# EAGLE design PCF8563-Bob-v1.0 (EAGLE 7.0.0)
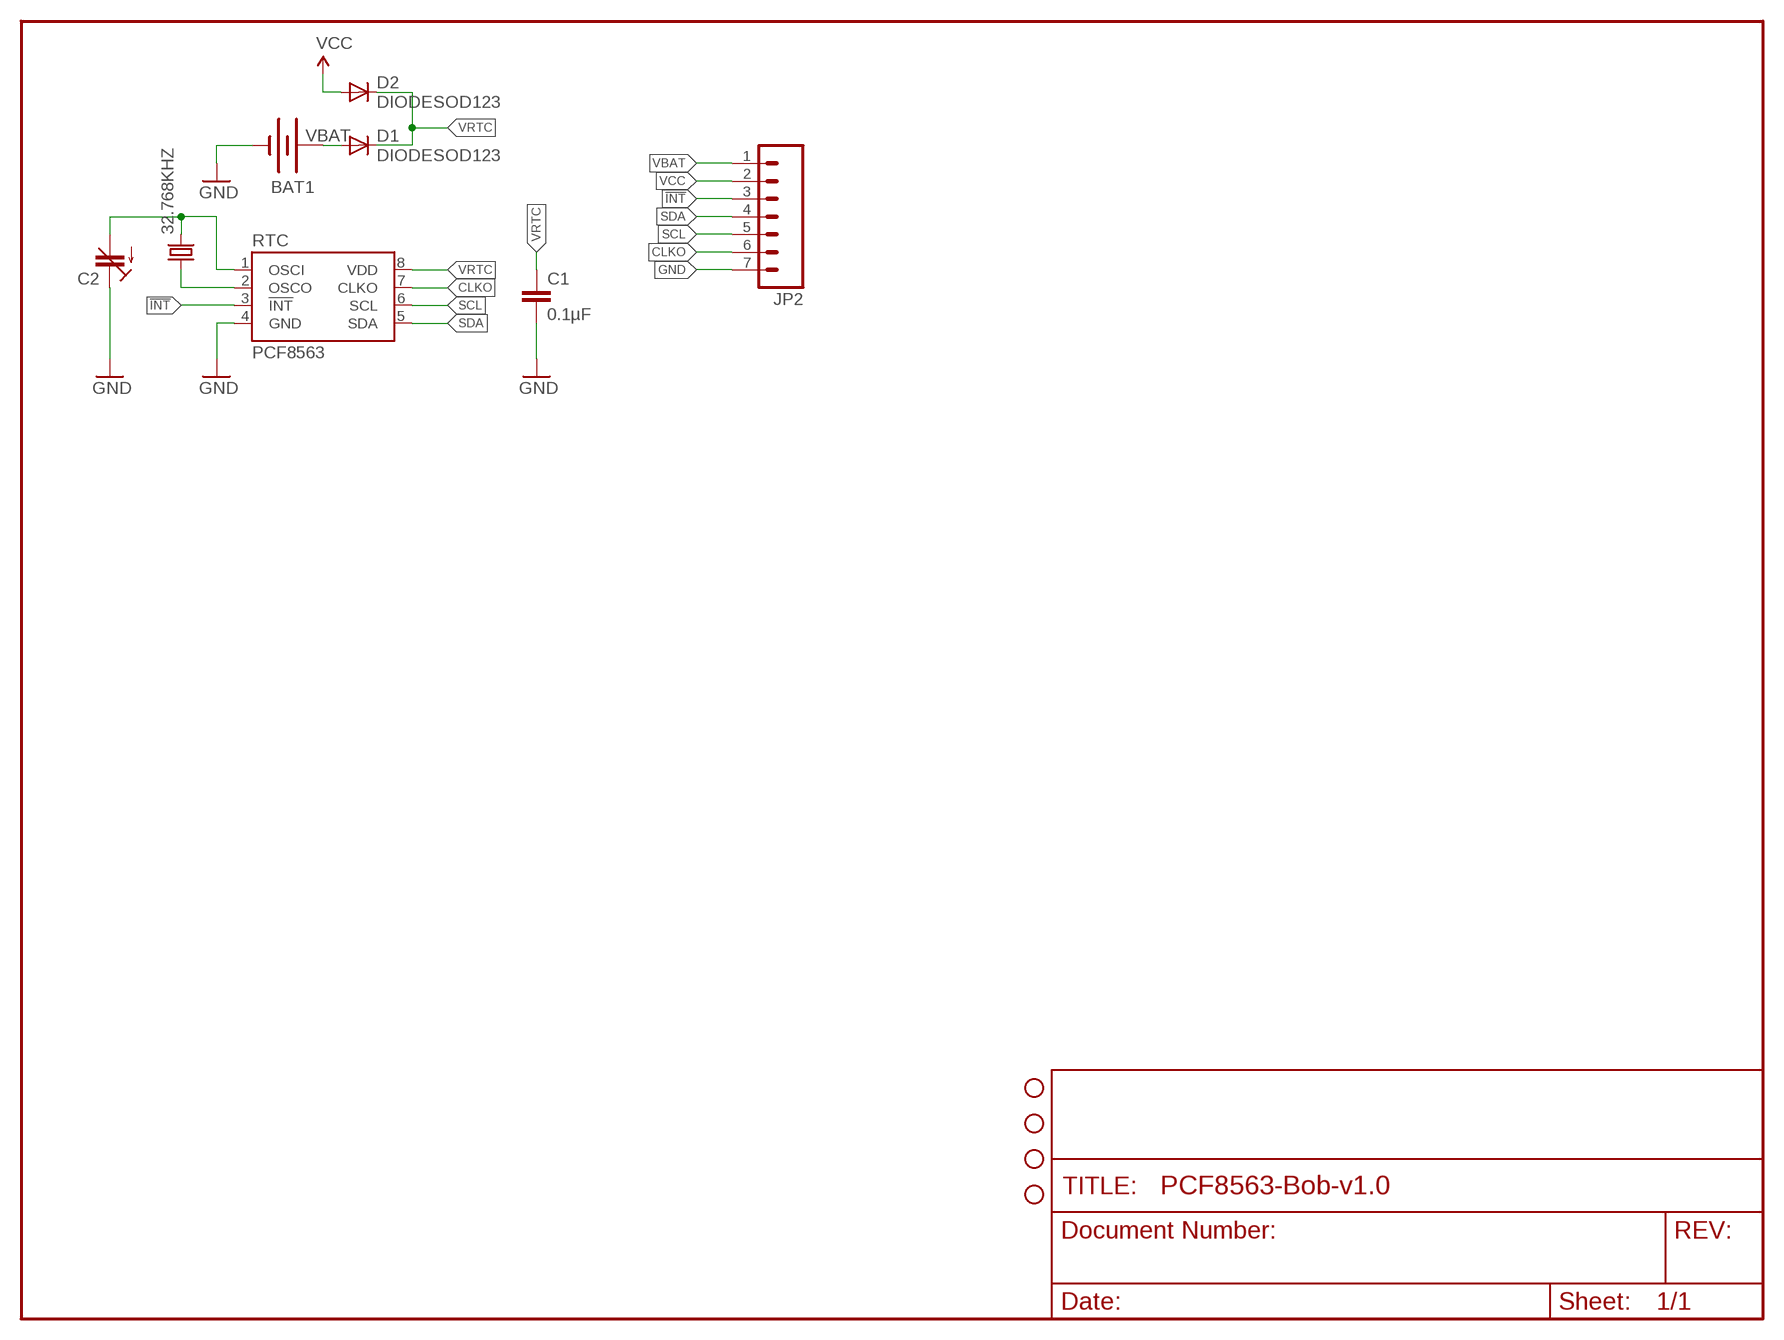
[diagram p0: schematic, sheet 1]

## Parts
32.768KHZ  CRYSTAL32-SMD  [CRYSTAL-32KHZ-SMD]
BAT1  BATTERY12SMD  [HOLDER12SMD]
C1  0.1µF  CAP1206  [1206]
C2  C-TRIMMTZC3  [CTRIMTZC3]
D1  DIODESOD123  [SOD123]
D2  DIODESOD123  [SOD123]
JP2  M07  [1X07]
RTC  PCF8563  RTCPCF8563  [DIL-08]
STANDOFF1  STAND-OFF  [STAND-OFF]
STANDOFF2  STAND-OFF  [STAND-OFF]
STANDOFF3  STAND-OFF  [STAND-OFF]
STANDOFF4  STAND-OFF  [STAND-OFF]

## Nets
!INT: JP2.3 RTC.3(!INT)
CLKO: JP2.6 RTC.7(CLKO)
GND: BAT1.GND(-) C1.2 C2.2(E) JP2.7 RTC.4(GND)
N$1: 32.768KHZ.X2 C2.1(A) RTC.1(OSCI)
N$2: 32.768KHZ.X1 RTC.2(OSCO)
SCL: JP2.5 RTC.6(SCL)
SDA: JP2.4 RTC.5(SDA)
VBAT: BAT1.PWR@1(+) BAT1.PWR@2(+) D1.1-A(A) JP2.1
VCC: D2.1-A(A) JP2.2
VRTC: C1.1 D1.2-C(C) D2.2-C(C) RTC.8(VDD)

## Library data of the parts
32.768KHZ = SparkFun-FreqCtrl:CRYSTAL: Various standard crystals. Proven footprints. Spark Fun Electronics SKU : COM-00534; PROD_ID: XTAL-07894
BAT1 = GetOffMyHack:BATTERY: Battery Holders Various common sizes : AA, AAA, 20mm coin cell and 12mm coin cell.
C1 = SparkFun-Capacitors:CAP: Capacitor Standard 0603 ceramic capacitor, and 0.1" leaded capacitor.
C2 = GetOffMyHack:C-TRIMM: Trimmer CAP
D1 D2 = GetOffMyHack:DIODE
JP2 = SparkFun-Connectors:M07: Header 7 Standard 7-pin 0.1" header. Use with straight break away headers (SKU : PRT-00116), right angle break away headers (PRT-00553), swiss pins (PRT-00743), machine pins (PRT-00117), and female headers (PRT-00115). NOTES ON THE VARIANTS LOCK and LOCK_LONGPADS... This footprint was designed to help hold the alignment of a through-hole component (i.e. 7-pin header) while soldering it into place. You may notice that each hole has been shifted either up or down by 0.005 of an inch from it's more standard position (which is usually a perfectly straight line). This slight alteration caused the pins (the squares in the middle) to touch the edges of the holes. Because they are alternating, it causes a "brace" to hold the header in place. 0.005 has proven to be the perfect amount of "off-center" position when using our standard breakaway headers. Although looks a little odd when you look at the bare footprint, once you have a header in there, the alteration is very hard to notice. Also, if you push a header all the way into place, it is covered up entirely on the bottom side. This idea of altering the position of holes to aid alignment will be further integrated into the Sparkfun Library for other footprints. It can help hold any component with 3 or more connection pins.
RTC = GetOffMyHack:RTC
STANDOFF1-STANDOFF4 = SparkFun-Electromechanical:STAND-OFF: #4 Stand Off This is the mechanical footprint for a #4 phillips button head screw. Use the keepout ring to avoid running the screw head into surrounding components. SKU : PRT-00447

## Board
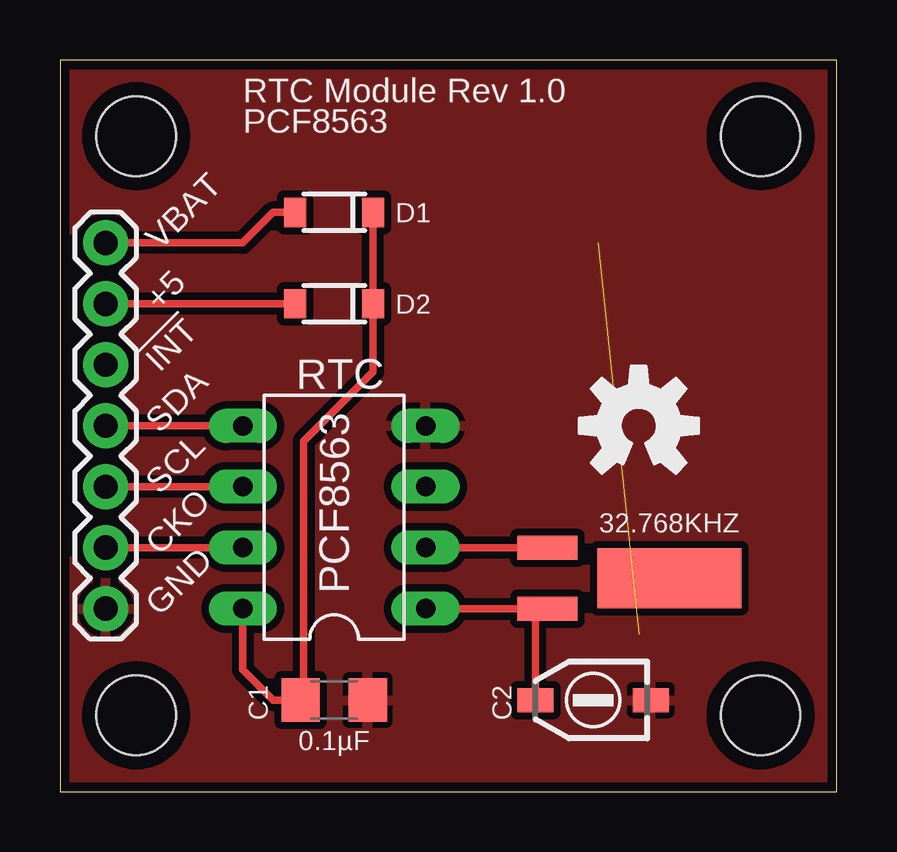
[diagram p1: board, top side]
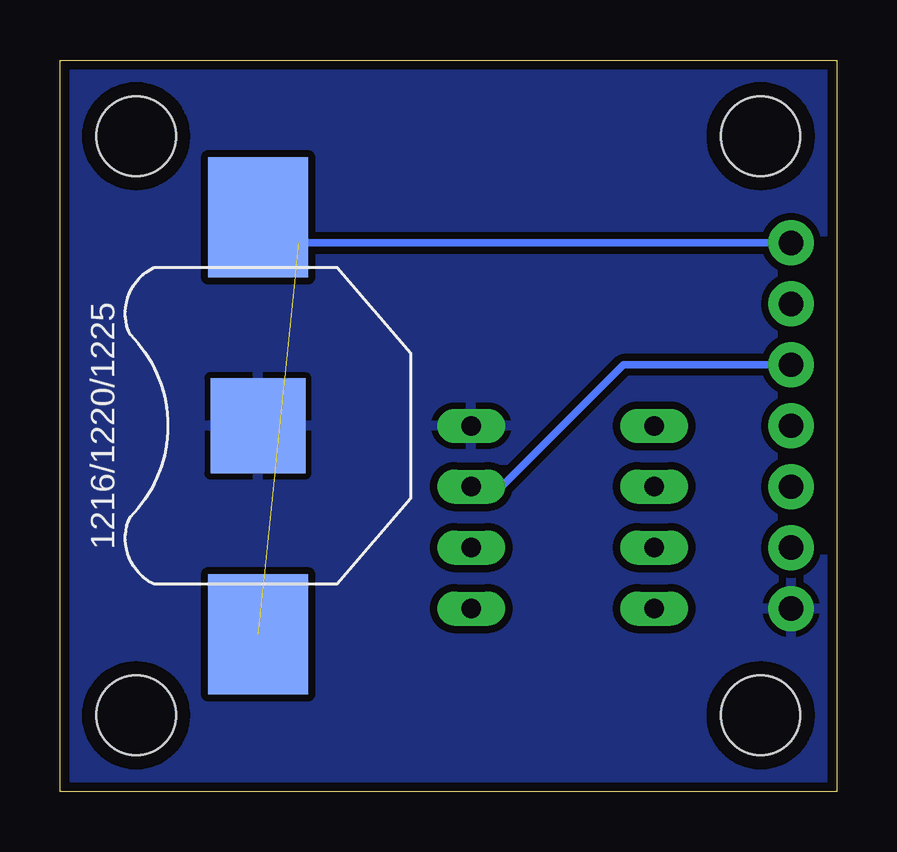
[diagram p2: board, bottom side, seen from below]

Size 32.38 x 30.48 mm. Coordinates in mm from the lower left corner, seen from the top.
Outline: 0,30.48 0,0 32.38,0 32.38,30.48 0,30.48
Copper layers (1*16): Top 0.0356mm / dielectric 1.5011mm / Bottom 0.0356mm
Design rules "OSHParkTest": minimum track width 6mil, minimum drill 13mil, track to track 6mil, track to pad 6mil, pad to pad 6mil, via to via 6mil, smd to smd 6mil, copper to edge 15mil, drill to drill 6mil, minimum pad ring 12mil, minimum via ring 7mil, stop-mask expansion 4mil, vias tented up to drill 0mil, thermal gap 10mil

### Footprints (pad centres in the part's own frame; a part is rotated, then mirrored left to right if it is on the bottom)
CRYSTAL-32KHZ-SMD = smd 2.5 x 6: SHEILD 0,5.08 | smd 1 x 2.5: X1 -1.27,0; X2 1.27,0
HOLDER12SMD = smd 3.96 x 3.96: GND 0,0 | smd 5 x 4.175: PWR@1 -8.685,0; PWR@2 8.685,0
1206 = smd 1.6 x 1.8: 1 -1.4,0; 2 1.4,0
CTRIMTZC3 = smd 1.5 x 1: 1 2.4,0; 2 -2.4,0
SOD123 = smd 0.914 x 1.219: 1-A -1.626,0; 2-C 1.626,0
1X07 = drill 1.016 pad 1.88: 1 0,0; 2 2.54,0; 3 5.08,0; 4 7.62,0; 5 10.16,0; 6 12.7,0; 7 15.24,0
DIL-08 = drill 0.813 long: 1 -3.81,-3.81; 2 -1.27,-3.81; 3 1.27,-3.81; 4 3.81,-3.81; 5 3.81,3.81; 6 1.27,3.81; 7 -1.27,3.81; 8 -3.81,3.81
STAND-OFF = hole 3.302: 0,0

### Placement (x,y rotation side)
32.768KHZ  20.32,8.89 270 top
BAT1  24.13,15.24 90 bottom
C1  11.43,3.81 0 top
C2  22.23,3.81 180 top
D1  11.43,24.13 0 top
D2  11.43,20.32 0 top
JP2  1.91,22.86 270 top
RTC  11.43,11.43 90 top
STANDOFF1  3.17,3.17 0 top
STANDOFF2  29.21,3.17 0 top
STANDOFF3  29.21,27.3 0 top
STANDOFF4  3.17,27.3 0 top
U$2  [OSHW-LOGO-M]  24.13,15.24 0 top

### Tracks (layer width: path | path; a pad name or v marks a point on that pad's centre or on a via)
!INT
  Bottom 0.305: JP2.3 8.89,17.78 13.97,12.7 RTC.3
CLKO
  Top 0.305: RTC.7 JP2.6
GND
  pour Bottom (isolate 0.305): 0,30.48 0,0 32.38,0 32.38,30.48
  pour Top (isolate 0.305): 0,30.48 0,0 32.38,0 32.38,30.48
N$1
  Top 0.305: RTC.1 32.768KHZ.X2 19.68,7.62 19.82,7.48 C2.1
N$2
  Top 0.305: 32.768KHZ.X1 RTC.2
SCL
  Top 0.305: RTC.6 JP2.5
SDA
  Top 0.305: RTC.5 JP2.4
VBAT  (1 unrouted)
  Top 0.305: D1.1-A 8.89,24.13 7.62,22.86 JP2.1
  Bottom 0.305: JP2.1 22.43,22.86 BAT1.PWR@2
VCC
  Top 0.305: D2.1-A JP2.2
VRTC
  Top 0.305: D1.2-C D2.2-C 13.06,17.5 10.16,14.61 10.16,4.58 C1.1 8.89,3.81 7.62,5.08 RTC.8

### Text on the board
_tsilk: RTC Module Rev 1.0 | PCF8563 | VBAT | +5 | !INT | SDA | SCL | CKO | GND
_bsilk: 1216/1220/1225